# EAGLE schematic CabInst (EAGLE 9.5.2)
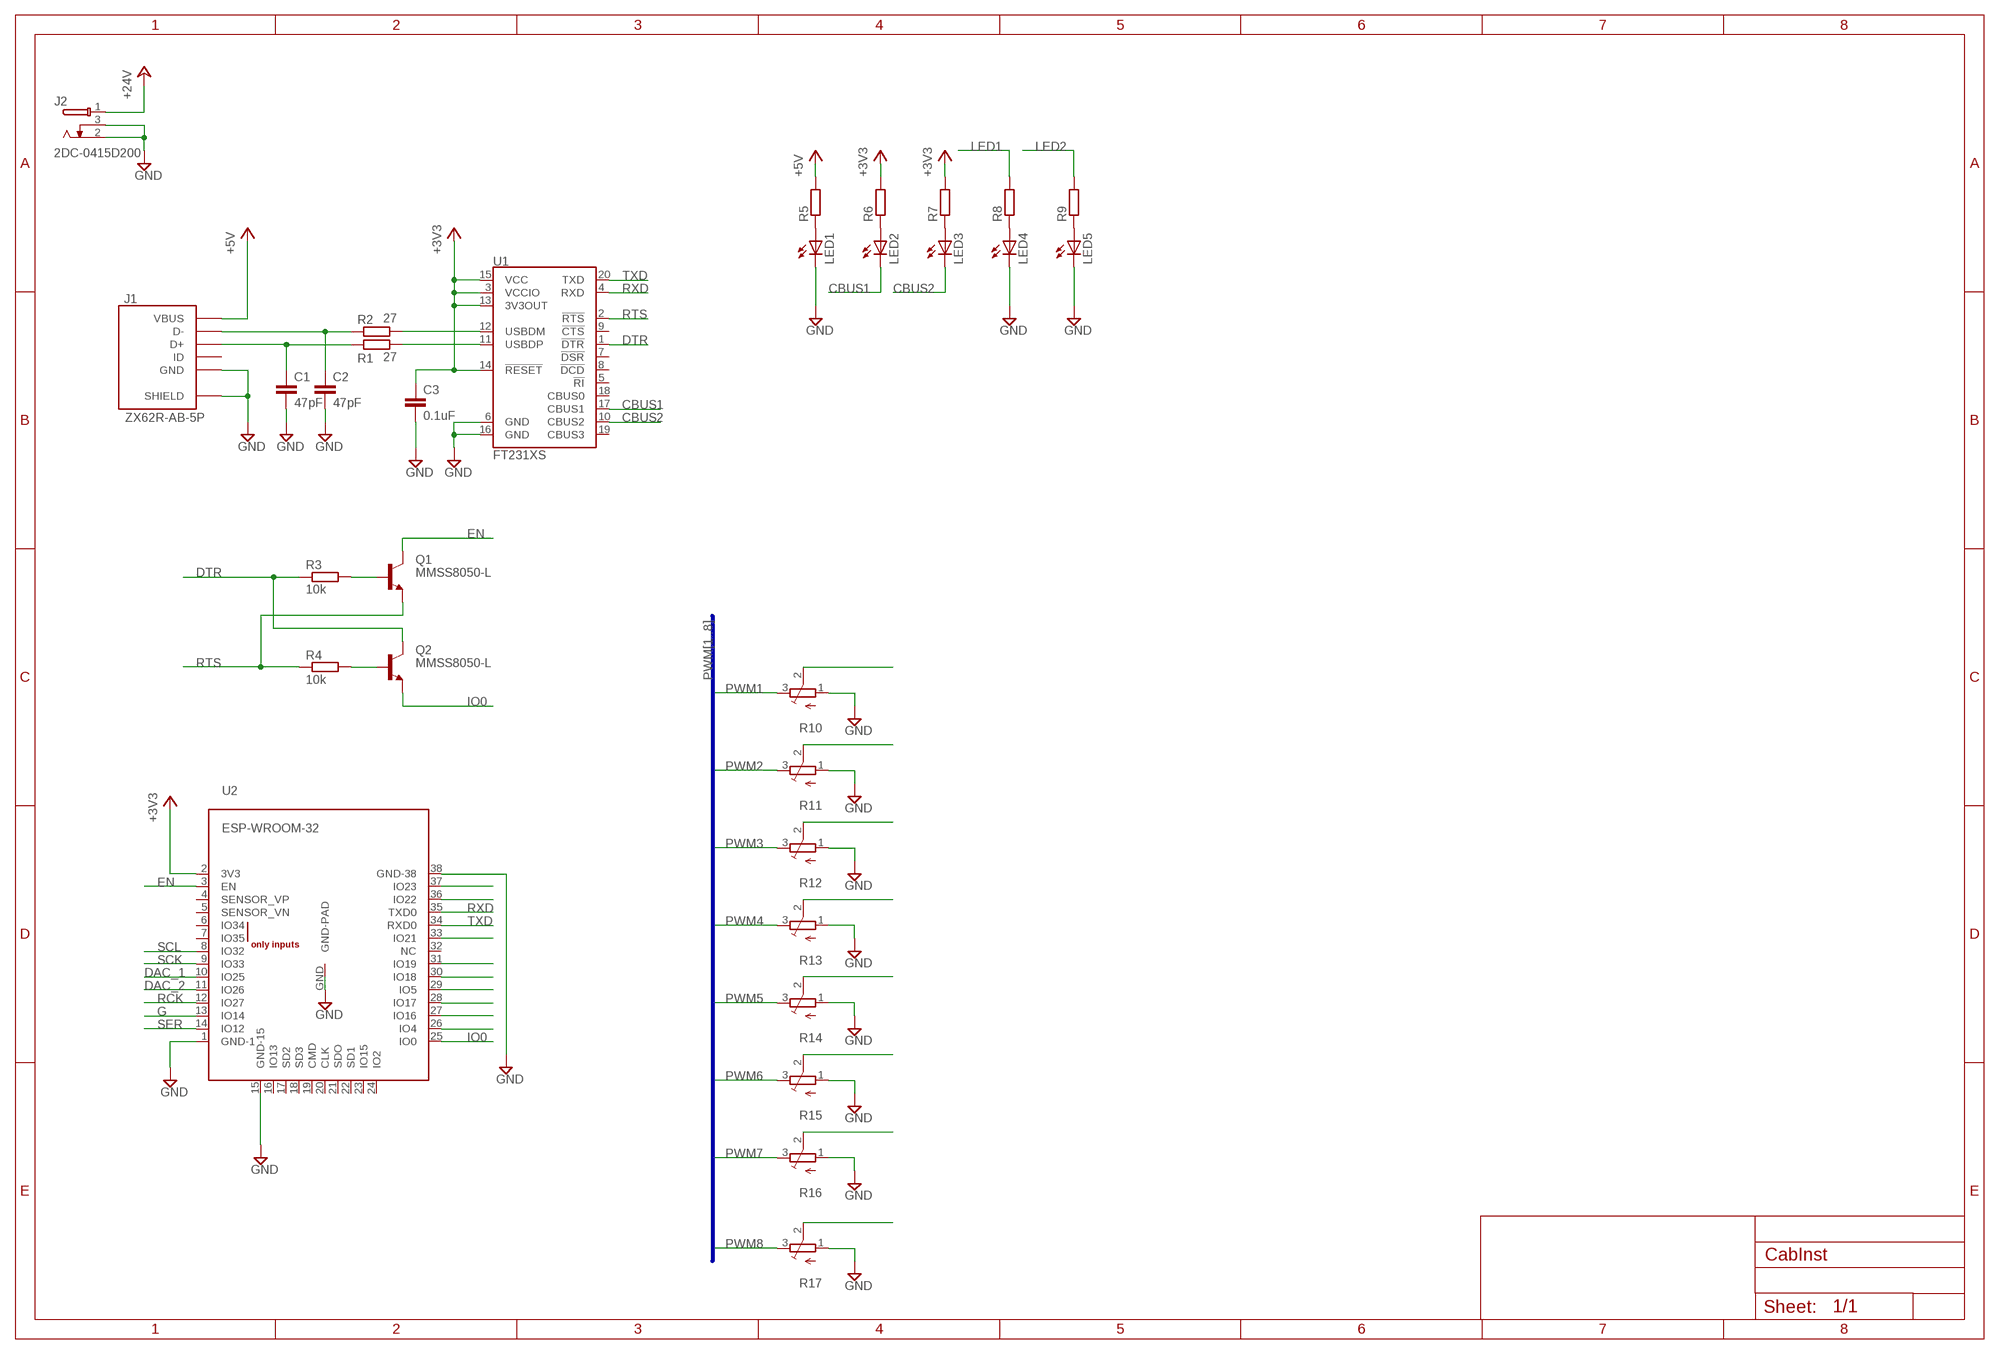
[diagram p0: schematic, sheet 1]

## Parts
C1  47pF  C-EUC0603  [C0603]
C2  47pF  C-EUC0603  [C0603]
C3  0.1uF  C-EUC0603  [C0603]
J1  ZX62R-AB-5P  [ZX62R-B-5PA]
J2  2DC-0415D200  [2DC-0415D200]
LED1  LEDCHIP-LED0603  [CHIP-LED0603]
LED2  LEDCHIP-LED0603  [CHIP-LED0603]
LED3  LEDCHIP-LED0603  [CHIP-LED0603]
LED4  LEDCHIP-LED0603  [CHIP-LED0603]
LED5  LEDCHIP-LED0603  [CHIP-LED0603]
Q1  MMSS8050-L  [SOT23]
Q2  MMSS8050-L  [SOT23]
R1  27  R-EU_R0603  [R0603]
R2  27  R-EU_R0603  [R0603]
R3  10k  R-EU_R0603  [R0603]
R4  10k  R-EU_R0603  [R0603]
R5  R-EU_R0603  [R0603]
R6  R-EU_R0603  [R0603]
R7  R-EU_R0603  [R0603]
R8  R-EU_R0603  [R0603]
R9  R-EU_R0603  [R0603]
R10  TRIM_EU-SM-42/43A  [SM-42/43A]
R11  TRIM_EU-SM-42/43A  [SM-42/43A]
R12  TRIM_EU-SM-42/43A  [SM-42/43A]
R13  TRIM_EU-SM-42/43A  [SM-42/43A]
R14  TRIM_EU-SM-42/43A  [SM-42/43A]
R15  TRIM_EU-SM-42/43A  [SM-42/43A]
R16  TRIM_EU-SM-42/43A  [SM-42/43A]
R17  TRIM_EU-SM-42/43A  [SM-42/43A]
U1  FT231XS  [SSOP20_L]
U2  ESP-WROOM-32  [ESP-WROOM-32]

## Nets
+3V3: C3.1 R6.2 R7.2 U1.3(VCCIO) U1.13(3V3OUT) U1.14(!RESET) U1.15(VCC) U2.2(3V3)
+5V: J1.VCC(VBUS) R5.2
+24V: J2.1
CBUS1: LED2.C U1.17(CBUS1)
CBUS2: LED3.C U1.10(CBUS2)
DAC_1: U2.10(IO25)
DAC_2: U2.11(IO26)
DTR: Q2.C R3.1 U1.1(!DTR)
EN: Q1.C U2.3(EN)
G: U2.13(IO14)
GND: C1.2 C2.2 C3.2 J1.GND J1.SHIELD@1(SHIELD) J1.SHIELD@2(SHIELD) J1.SHIELD@3(SHIELD) J1.SHIELD@4(SHIELD) J2.2 J2.3 LED1.C LED4.C LED5.C R10.1(A) R11.1(A) R12.1(A) R13.1(A) R14.1(A) R15.1(A) R16.1(A) R17.1(A) U1.6(GND) U1.16(GND) U2.1(GND-1) U2.15(GND-15) U2.38(GND-38) U2.GND(GND-PAD)
IO0: Q2.E U2.25(IO0)
LED1: R8.2
LED2: R9.2
N$1: C1.1 J1.D+ R1.1
N$2: C2.1 J1.D- R2.1
N$3: R1.2 U1.11(USBDP)
N$4: R2.2 U1.12(USBDM)
N$5: LED1.A R5.1
N$6: LED2.A R6.1
N$7: Q2.B R4.2
N$8: Q1.B R3.2
N$9: LED3.A R7.1
N$10: LED5.A R9.1
N$11: R13.2(S)
N$12: LED4.A R8.1
N$13: R14.2(S)
N$14: R15.2(S)
N$15: R12.2(S)
N$16: R11.2(S)
N$17: R10.2(S)
N$18: R16.2(S)
N$19: R17.2(S)
N$21: U2.30(IO18)
N$22: U2.29(IO5)
N$23: U2.28(IO17)
N$24: U2.27(IO16)
N$25: U2.26(IO4)
N$27: U2.37(IO23)
N$28: U2.36(IO22)
N$31: U2.33(IO21)
N$33: U2.31(IO19)
PWM1: R10.3(E)
PWM2: R11.3(E)
PWM3: R12.3(E)
PWM4: R13.3(E)
PWM5: R14.3(E)
PWM6: R15.3(E)
PWM7: R16.3(E)
PWM8: R17.3(E)
RCK: U2.12(IO27)
RTS: Q1.E R4.1 U1.2(!RTS)
RXD: U1.4(RXD) U2.35(TXD0)
SCK: U2.9(IO33)
SCL: U2.8(IO32)
SER: U2.14(IO12)
TXD: U1.20(TXD) U2.34(RXD0)
Unconnected: J1.ID U1.5(!RI) U1.7(!DSR) U1.8(!DCD) U1.9(!CTS) U1.18(CBUS0) U1.19(CBUS3) U2.4(SENSOR_VP) U2.5(SENSOR_VN) U2.6(IO34) U2.7(IO35) U2.16(IO13) U2.17(SD2) U2.18(SD3) U2.19(CMD) U2.20(CLK) U2.21(SDO) U2.22(SD1) U2.23(IO15) U2.24(IO2) U2.32(NC)

## Buses
PWM[1..8]

## Library data of the parts
C1-C3 = CabInst:C-EU: CAPACITOR, European symbol
J1 = CabInst:ZX62
J2 = CabInst:2DC-0415D200
LED1-LED5 = CabInst:LED: LED OSRAM: - CHIPLED LG R971, LG N971, LY N971, LG Q971, LY Q971, LO R971, LY R971 LH N974, LH R974 LS Q976, LO Q976, LY Q976 LO Q996 - Hyper CHIPLED LW Q18S LB Q993, LB Q99A, LB R99A - SideLED LS A670, LO A670, LY A670, LG A670, LP A670 LB A673, LV A673, LT A673, LW A673 LH A674 LY A675 LS A676, LA A676, LO A676, LY A676, LW A676 LS A679, LY A679, LG A679 - Hyper Micro SIDELED® LS Y876, LA Y876, LO Y876, LY Y876 LT Y87S - SmartLED LW L88C, LW L88S LB L89C, LB L89S, LG L890 LS L89K, LO L89K, LY L89K LS L896, LA L896, LO L896, LY L896 - TOPLED LS T670, LO T670, LY T670, LG T670, LP T670 LSG T670, LSP T670, LSY T670, LOP T670, LYG T670 LG T671, LOG T671, LSG T671 LB T673, LV T673, LT T673, LW T673 LH T674 LS T676, LA T676, LO T676, LY T676, LB T676, LH T676, LSB T676, LW T676 LB T67C, LV T67C, LT T67C, LS T67K, LO T67K, LY T67K, LW E67C LS E67B, LA E67B, LO E67B, LY E67B, LB E67C, LV E67C, LT E67C LW T67C LS T679, LY T679, LG T679 LS T770, LO T770, LY T770, LG T770, LP T770 LB T773, LV T773, LT T773, LW T773 LH T774 LS E675, LA E675, LY E675, LS T675 LS T776, LA T776, LO T776, LY T776, LB T776 LHGB T686 LT T68C, LB T68C - Hyper Mini TOPLED® LB M676 - Mini TOPLED Santana® LG M470 LS M47K, LO M47K, LY M47K Source: http://www.osram.convergy.de LUXEON: - LUMILED® LXK2-PW12-R00, LXK2-PW12-S00, LXK2-PW14-U00, LXK2-PW14-V00 LXK2-PM12-R00, LXK2-PM12-S00, LXK2-PM14-U00 LXK2-PE12-Q00, LXK2-PE12-R00, LXK2-PE12-S00, LXK2-PE14-T00, LXK2-PE14-U00 LXK2-PB12-K00, LXK2-PB12-L00, LXK2-PB12-M00, LXK2-PB14-N00, LXK2-PB14-P00, LXK2-PB14-Q00 LXK2-PR12-L00, LXK2-PR12-M00, LXK2-PR14-Q00, LXK2-PR14-R00 LXK2-PD12-Q00, LXK2-PD12-R00, LXK2-PD12-S00 LXK2-PH12-R00, LXK2-PH12-S00 LXK2-PL12-P00, LXK2-PL12-Q00, LXK2-PL12-R00 Source: www.luxeon.com KINGBRIGHT: KA-3528ASYC Source: www.kingbright.com
Q1 Q2 = CabInst:MMSS8050: Bipolar (BJT) Transistor NPN 25V 1.5A 100MHz 625mW Surface Mount SOT-23; DIGIKEY_URL: https://www.digikey.jp/product-detail/ja/micro-commercial-co/MMSS8050-L-TP/MMSS8050-L-TPMSCT-ND/2827203; MARUTSU_URL: https://www.marutsu.co.jp/pc/i/15861860/; STORE: MARUTSU; URL: https://www.marutsu.co.jp/pc/i/15861860/
R1-R9 = CabInst:R-EU_: RESISTOR, European symbol
R10-R17 = CabInst:TRIM_EU-: POTENTIOMETER
U1 = CabInst:FT231X: FTDI FT231X Full Speed USB to Full-handshake UART This USB2.0 Full Speed IC offers a compact bridge to full handshake UART interfaces. The device is a UART, capable of operating up to 3MBaud, with low power consumption (8mA). The FT231X includes the complete FT-X series feature set and enables USB to be added into a system design quickly and easily over a UART interface. Datasheet <http://cdn.sparkfun.com/datasheets/Components/General%20IC/DS_FT231X.pdf> SparkFun Products SparkFun RedBoard - Programmed with Arduino <https://www.sparkfun.com/products/12757> (DEV-12757) SparkFun XBee Explorer USB <https://www.sparkfun.com/products/11812> (WRL-11812) SparkFun XBee Explorer Dongle <https://www.sparkfun.com/products/11697> (WRL-11697) SparkFun Blynk Board - ESP8266 <https://www.sparkfun.com/products/13794> (WRL-13794) SparkFun ESP8266 Thing - Dev Board <https://www.sparkfun.com/products/13711> (WRL-13711) SparkFun Block for Intel® Edison - Base <https://www.sparkfun.com/products/13045> (DEV-13045) SparkFun RedStick <https://www.sparkfun.com/products/13741> (DEV-13741) SparkFun Beefy 3 - FTDI Basic Breakout <https://www.sparkfun.com/products/13746> (DEV-13746) SparkFun FT231X Breakout <https://www.sparkfun.com/products/11736> (BOB-11736); PROD_ID: IC-11524
U2 = CabInst:ESP-WROOM-32